# Altium schematic sheet shutdown_circuit.SchDoc
size A4
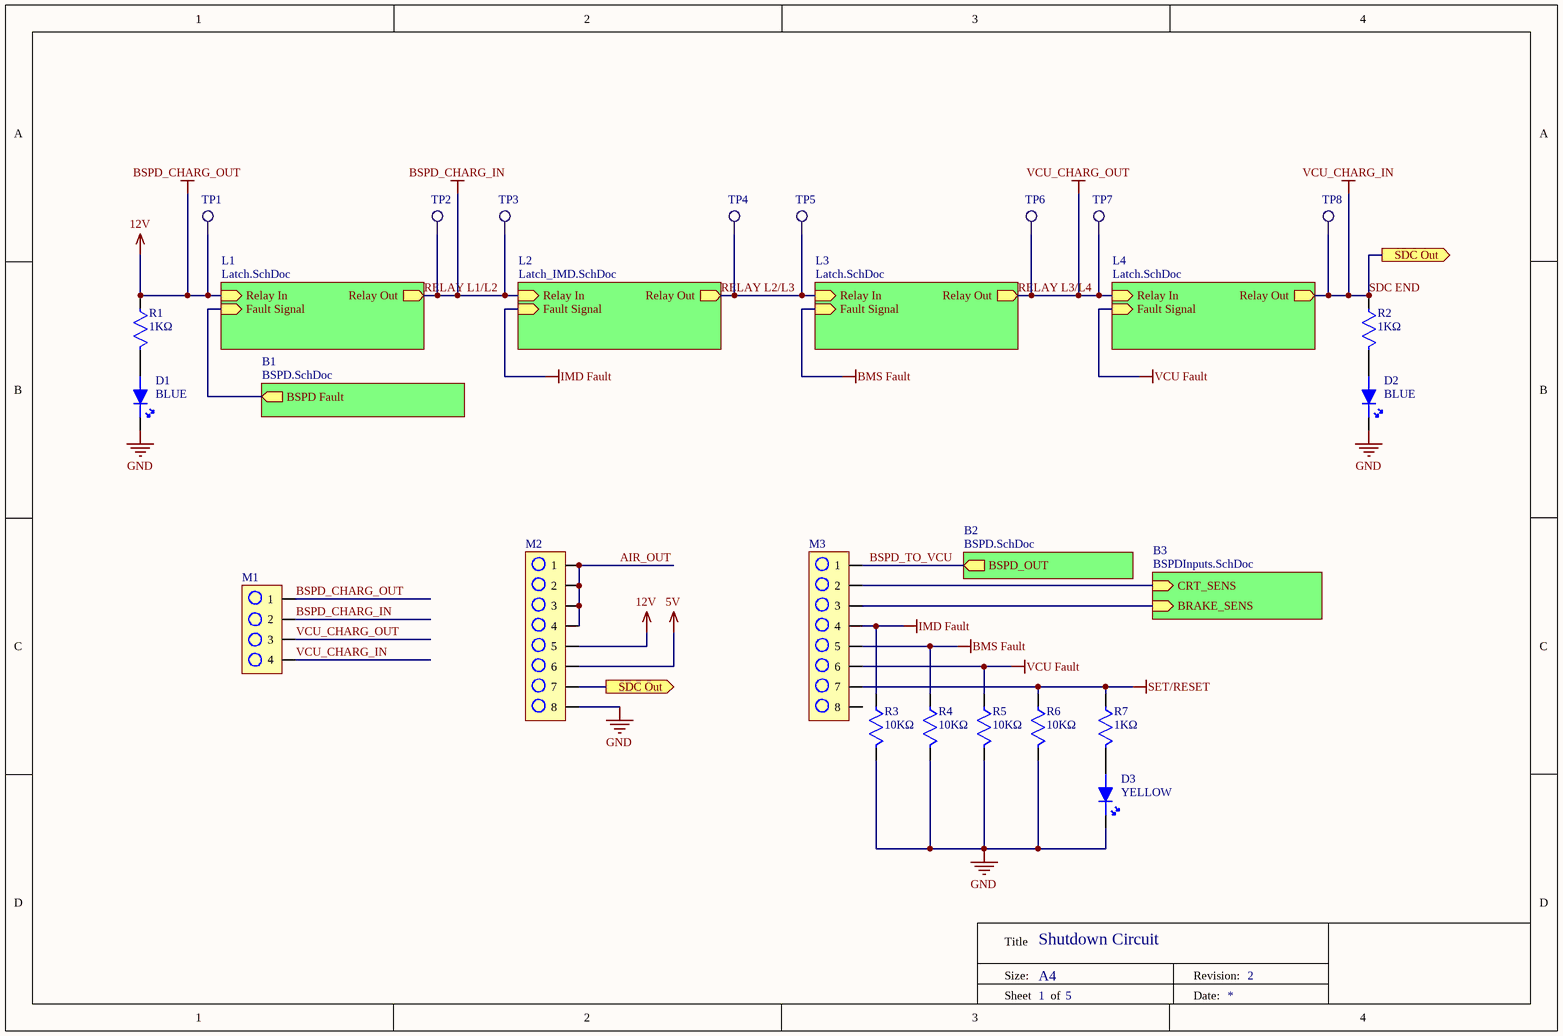
[diagram p0: shutdown_circuit.SchDoc]

## Parts
D1  BLUE  [LED 0603]
D2  BLUE  [LED 0603]
D3  YELLOW  [LED 0603]
M1  0436500428  [4-PIN MOLEX]  (value not drawn)
M2  2068320802  [4X2-PIN MOLEX]  (value not drawn)
M3  2068320802  [4X2-PIN MOLEX]  (value not drawn)
R1  1KΩ  [RESISTOR 0603]
R2  1KΩ  [RESISTOR 0603]
R3  10KΩ  [RESISTOR 0603]
R4  10KΩ  [RESISTOR 0603]
R5  10KΩ  [RESISTOR 0603]
R6  10KΩ  [RESISTOR 0603]
R7  1KΩ  [RESISTOR 0603]
TP1  Testpoint2  [TP2]  (value not drawn)
TP2  Testpoint2  [TP2]  (value not drawn)
TP3  Testpoint2  [TP2]  (value not drawn)
TP4  Testpoint2  [TP2]  (value not drawn)
TP5  Testpoint2  [TP2]  (value not drawn)
TP6  Testpoint2  [TP2]  (value not drawn)
TP7  Testpoint2  [TP2]  (value not drawn)
TP8  Testpoint2  [TP2]  (value not drawn)

## Sub-sheets
B1 = BSPD.SchDoc: BSPD Fault (out)
B2 = BSPD.SchDoc: BSPD_OUT (out)
B3 = BSPDInputs.SchDoc: CRT_SENS (in), BRAKE_SENS (in)
L1 = Latch.SchDoc: Relay In (in), Relay Out (out), Fault Signal (in)
L2 = Latch_IMD.SchDoc: Relay In (in), Relay Out (out), Fault Signal (in)
L3 = Latch.SchDoc: Relay In (in), Relay Out (out), Fault Signal (in)
L4 = Latch.SchDoc: Relay In (in), Relay Out (out), Fault Signal (in)

## Ports
SDC Out (out)

## Nets
5V: M2.6
BMS Fault: M3.5 R4.1 ; sheet L3/Fault Signal
BSPD_CHARG_IN: M1.2 TP2.1 TP3.1 ; sheet L1/Relay Out, sheet L2/Relay In  [also labelled RELAY L1/L2]
BSPD_CHARG_OUT: M1.1 M2.5 R1.1 TP1.1 ; sheet L1/Relay In  [also labelled 12V]
GND: D1.2 D2.2 D3.2 M2.8 R3.2 R4.2 R5.2 R6.2
IMD Fault: M3.4 R3.1 ; sheet L2/Fault Signal
RELAY L3/L4: M1.3 TP6.1 TP7.1 ; sheet L3/Relay Out, sheet L4/Relay In  [also labelled VCU_CHARG_OUT]
SDC END: M1.4 M2.7 R2.1 TP8.1 ; port SDC Out, sheet L4/Relay Out  [also labelled VCU_CHARG_IN]
SET/RESET: M3.7 R6.1 R7.1
VCU Fault: M3.6 R5.1 ; sheet L4/Fault Signal
AIR_OUT: M2.1 M2.2 M2.3 M2.4
BSPD_TO_VCU: M3.1 ; sheet B2/BSPD_OUT
RELAY L2/L3: TP4.1 TP5.1 ; sheet L2/Relay Out, sheet L3/Relay In
NetD1_1: D1.1 R1.2
NetD2_1: D2.1 R2.2
NetD3_1: D3.1 R7.2
NetM3_2: M3.2 ; sheet B3/CRT_SENS
NetM3_3: M3.3 ; sheet B3/BRAKE_SENS
(unnamed): sheet L1/Fault Signal, sheet B1/BSPD Fault

Not connected (* = marked no-connect by the designer): M3 8

## Notes on the sheet
- Shutdown Circuit
- 2
- 1
- 5
- Title
- Size:
- A4
- Revision:
- Sheet
- of
- Date:

## Library data of the parts
D1 D2 = LTST-C191TBKT-5A: LED BLUE CLEAR CHIP SMD; Manufacturer: Vishay Lite-On; Lens Color: Colorless; Lens Style: Diffused,Colorless,Rectangular; Viewing Angle: 130°; Forward Current: 20mA; Forward Voltage: 2.8V; Luminous Intensity: 15mcd; Test Current: 5mA; Dominant Wavelength: 473nm; Number of LEDs: 1; Voltage: 29V; Supplier 1: Digi-Key; Manufacturer Part Number: LTST-C191TBKT-5A; Stock 1: 9654; Pricing 1: 1=0.5, 10=0.359, 100=0.1596, 500=0.11172, 1000=0.09177, 2500=0.0798 (USD); Mount: Surface Mount; Case/Package: 0603; Number of Pins: 2; Color: Blue; Case Code (Metric): 1608; Case Code (Imperial): 0603; Min Operating Temperature: -20°C; Max Operating Temperature: 80°C; Packaging: Tape and Reel; Package Quantity: 5000; Illumination Color: Blue; Lens Transparency: Clear; Length: 1.6mm; Height: 0.55mm; Width: 0.8mm; Radiation Hardening: No; ComponentLink1URL: http://optoelectronics.liteon.com/upload/download/DS22-2003-020/LTST-C191TBKT-5A.pdf?src-supplier=Digi-Key; ComponentLink1Description: http://optoelectronics.liteon.com/upload/download/DS22-2003-020/LTST-C191TBKT-5A.pdf?src-supplier=Digi-Key; ComponentLink2URL: http://components.arrow.com/part/dataview/52218576S9813001N1331?src-supplier=Arrow; ComponentLink2Description: http://components.arrow.com/part/dataview/52218576S9813001N1331?src-supplier=Arrow; ComponentLink3URL: http://optoelectronics.liteon.com/zh-cn/api/DwonloadFileHandler.ashx?txtSpecNo=DS22-2003-020&txtPartNo=LTST-C191TBKT-5A&src-supplier=Avnet; ComponentLink3Description: http://optoelectronics.liteon.com/zh-cn/api/DwonloadFileHandler.ashx?txtSpecNo=DS22-2003-020&txtPartNo=LTST-C191TBKT-5A&src-supplier=Avnet; ComponentLink4URL: http://www.mouser.com/ds/2/239/LTST-C191TBKT-5A-1150649.pdf?src-supplier=Mouser; ComponentLink4Description: http://www.mouser.com/ds/2/239/LTST-C191TBKT-5A-1150649.pdf?src-supplier=Mouser; Supplier Part Number 1: 160-2212-6-ND; Category: Optoelectronics
D3 = LTST-C191KSKT: LED YELLOW CLEAR SMD; Manufacturer: Vishay Lite-On; Lens Color: Colorless; Viewing Angle: 130°; Lens Style: Diffused,Colorless,Rectangular,Clear; Luminous Intensity: 180mcd; Forward Current: 30mA; Forward Voltage: 2.4V; Power Rating: 75mW; Dominant Wavelength: 597nm; Test Current: 20mA; Number of Elements: 1; Wavelength: 588nm; Reverse Voltage: 5V; Supplier 1: Digi-Key; Manufacturer Part Number: LTST-C191KSKT; Stock 1: 464545; Pricing 1: 1=0.29, 10=0.215, 100=0.1016, 500=0.06774, 1000=0.05306, 2500=0.05194 (USD); Mount: Surface Mount; Case/Package: 0603; Number of Pins: 2; Color: Yellow; Case Code (Metric): 1608; Case Code (Imperial): 0603; Min Operating Temperature: -55°C; Max Operating Temperature: 85°C; Package Quantity: 1; Packaging: Tape and Reel; Illumination Color: Yellow; Lens Transparency: Clear; Power Dissipation: 75mW; Number of LEDs: 1; Length: 1.6mm; Height: 0.55mm; Width: 0.8mm; Depth: 0.8mm; Radiation Hardening: No; Lead Free: Lead Free; ComponentLink1URL: http://optoelectronics.liteon.com/upload/download/DS22-2000-224/LTST-C191KSKT.PDF?src-supplier=Digi-Key; ComponentLink1Description: http://optoelectronics.liteon.com/upload/download/DS22-2000-224/LTST-C191KSKT.PDF?src-supplier=Digi-Key; ComponentLink2URL: https://www.verical.com/server-webapp/html/getDatasheet?partID=141495&src-supplier=Verical; ComponentLink2Description: https://www.verical.com/server-webapp/html/getDatasheet?partID=141495&src-supplier=Verical; ComponentLink3URL: http://www.mouser.com/ds/2/239/LTST-C191KSKT-1141271.pdf?src-supplier=Mouser; ComponentLink3Description: http://www.mouser.com/ds/2/239/LTST-C191KSKT-1141271.pdf?src-supplier=Mouser; ComponentLink4URL: http://www1.futureelectronics.com/doc/LITE%20ON/LITE-ON%20LTST-C191KSKT.pdf?src-supplier=Future+Electronics; ComponentLink4Description: http://www1.futureelectronics.com/doc/LITE%20ON/LITE-ON%20LTST-C191KSKT.pdf?src-supplier=Future+Electronics; Category: Optoelectronics; Supplier Part Number 1: 160-1448-6-ND
M1 = 0436500428: Conn Power HDR 4 POS 3mm Solder ST Thru-Hole 4 Terminal 1 Port Micro-Fit 3.0™ Tray; Manufacturer: Molex; Number of Positions: 4; Connector Type: Male Pin; Number of Ports: 1; Supplier 1: Digi-Key; Manufacturer Part Number: 0436500428; Stock 1: 1193; Pricing 1: 1=1.44, 10=1.265, 100=1.0916, 500=0.89316, 1000=0.79392, 5000=0.69468, 10000=0.65995 (USD); Mount: Through Hole; Contact Plating: Gold; Color: Black; Contact Material: Brass; Housing Material: Polymer; Number of Terminals: 4; Min Operating Temperature: -40°C; Max Operating Temperature: 105°C; Packaging: Tray; Number of Rows: 1; Termination: Solder; Fastening Type: Ramp; Number of Contacts: 4; Orientation: Straight; Package Quantity: 2040; Length: 15.65mm; Pitch: 3mm; Depth: 5.57mm; ComponentLink1URL: http://www.molex.com/pdm_docs/sd/436500428_sd.pdf?src-supplier=Digi-Key; ComponentLink1Description: http://www.molex.com/pdm_docs/sd/436500428_sd.pdf?src-supplier=Digi-Key; ComponentLink2URL: http://www.molex.com/webdocs/datasheets/pdf/en-us/0436500428_PCB_HEADERS.pdf?src-supplier=Avnet; ComponentLink2Description: http://www.molex.com/webdocs/datasheets/pdf/en-us/0436500428_PCB_HEADERS.pdf?src-supplier=Avnet; Supplier Part Number 1: WM10669-ND; Category: Connectors, Interconnects
M2 M3 = 2068320802: CONN HEADER 4X2 POS, 3.00mm Pitch; Vendor: Molex Connector Corporation; Built_By: Molex_Team; SourceLibrary: Molex_2020-09-22; Manufacturer_Part_Number: 2068320802; Copyright: Copyright (C) 2018 Accelerated Designs. All rights reserved; RefDes: RefDes; Type: DEV
R1 R2 R7 = CRCW06031K00FKEA: RES SMD 1K OHM 1% 1/10W 0603; Manufacturer: Vishay Dale; Resistance: 1kR; Temperature Coefficient: 100ppm/°C; Power Rating: 100mW; Voltage Rating: 75V; Supplier 1: Digi-Key; Manufacturer Part Number: CRCW06031K00FKEA; Stock 1: 1811474; Pricing 1: 1=0.1, 10=0.034, 100=0.0139, 1000=0.00623, 2500=0.0054 (USD); Mount: Surface Mount; Case/Package: 0603; Number of Pins: 2; Weight: 7.1E-05oz; Contact Plating: Tin; Case Code (Metric): 1608; Case Code (Imperial): 0603; Min Operating Temperature: -55°C; Max Operating Temperature: 155°C; Composition: Thick Film; Tolerance: 1%; Termination: SMD/SMT; Packaging: Tape and Reel; Package Quantity: 10; Number of Terminations: 2; Military Standard: Not; Max Power Dissipation: 100mW; Voltage Rating (DC): 75V; Features: Automotive AEC-Q200; Length: 1.55mm; Height: 0.45mm; Width: 0.033inch; Depth: 0.85mm; Radiation Hardening: No; Lead Free: Lead Free; REACH SVHC: Unknown; ComponentLink1URL: http://www.vishay.com/docs/20035/dcrcwe3.pdf?src-supplier=Digi-Key; ComponentLink1Description: http://www.vishay.com/docs/20035/dcrcwe3.pdf?src-supplier=Digi-Key; ComponentLink2URL: http://uk.rs-online.com/webdocs/0d98/0900766b80d98afc.pdf?src-supplier=RSComponents; ComponentLink2Description: http://uk.rs-online.com/webdocs/0d98/0900766b80d98afc.pdf?src-supplier=RSComponents; ComponentLink3URL: http://www.vishay.com/docs/20035/dcrcwe3.pdf?src-supplier=Avnet; ComponentLink3Description: http://www.vishay.com/docs/20035/dcrcwe3.pdf?src-supplier=Avnet; ComponentLink4URL: http://www.vishay.com/docs/20035/dcrcwe3.pdf?src-supplier=Avnet+Asia; ComponentLink4Description: http://www.vishay.com/docs/20035/dcrcwe3.pdf?src-supplier=Avnet+Asia; ComponentLink5URL: http://www.farnell.com/datasheets/2310790.pdf?src-supplier=Element14; ComponentLink5Description: http://www.farnell.com/datasheets/2310790.pdf?src-supplier=Element14; ComponentLink6URL: https://www.distrelec.biz/Web/Downloads/a_/en/flD-CRCW-e3_data_en.pdf?mime=application%2Fpdf&src-supplier=Distrelec; ComponentLink6Description: https://www.distrelec.biz/Web/Downloads/a_/en/flD-CRCW-e3_data_en.pdf?mime=application%2Fpdf&src-supplier=Distrelec; ComponentLink7URL: http://www.vishay.com/docs/20035/dcrcwe3.pdf?src-supplier=Future+Electronics; ComponentLink7Description: http://www.vishay.com/docs/20035/dcrcwe3.pdf?src-supplier=Future+Electronics; ComponentLink8URL: http://www.vishay.com/docs/20035/dcrcwe3.pdf?src-supplier=Avnet+Europe; ComponentLink8Description: http://www.vishay.com/docs/20035/dcrcwe3.pdf?src-supplier=Avnet+Europe; Supplier Part Number 1: 541-1.00KHCT-ND; Category: Resistors
R3-R6 = CRCW060310K0FKEA: RES SMD 10K OHM 1% 1/10W 0603; Manufacturer: Vishay; Resistance: 10kR; Temperature Coefficient: 100ppm/°C; Power Rating: 100mW; Voltage Rating: 75V; Supplier 1: Digi-Key; Manufacturer Part Number: CRCW060310K0FKEA; Stock 1: 1434373; Pricing 1: 1=0.1, 10=0.034, 100=0.0139, 1000=0.00623, 2500=0.0054 (USD); Case/Package: 0603; Number of Pins: 2; Weight: 7.1E-05oz; Contact Plating: Tin,Lead; Case Code (Metric): 1608; Case Code (Imperial): 0603; Min Operating Temperature: -55°C; Max Operating Temperature: 155°C; Tolerance: 1%; Composition: Thick Film; Packaging: Tape and Reel; Package Quantity: 10; Number of Terminations: 2; Military Standard: Not; Termination: SMD/SMT; Max Power Dissipation: 100mW; Voltage Rating (DC): 75V; Features: Automotive AEC-Q200; Length: 1.55mm; Height: 0.45mm; Width: 0.033inch; Depth: 0.85mm; Radiation Hardening: No; Lead Free: Lead Free; REACH SVHC: Unknown; ComponentLink1URL: http://www.vishay.com/docs/20008/dcrcw.pdf?src-supplier=Avnet+Europe; ComponentLink1Description: http://www.vishay.com/docs/20008/dcrcw.pdf?src-supplier=Avnet+Europe; ComponentLink2URL: https://www.verical.com/server-webapp/html/getDatasheet?partID=86831&src-supplier=Verical; ComponentLink2Description: https://www.verical.com/server-webapp/html/getDatasheet?partID=86831&src-supplier=Verical; ComponentLink3URL: http://www.farnell.com/datasheets/2310790.pdf?src-supplier=Allied+Electronics; ComponentLink3Description: http://www.farnell.com/datasheets/2310790.pdf?src-supplier=Allied+Electronics; ComponentLink4URL: http://www.vishay.com/docs/20035/dcrcwe3.pdf?src-supplier=Digi-Key; ComponentLink4Description: http://www.vishay.com/docs/20035/dcrcwe3.pdf?src-supplier=Digi-Key; ComponentLink5URL: http://www.farnell.com/datasheets/2310790.pdf?src-supplier=Mouser; ComponentLink5Description: http://www.farnell.com/datasheets/2310790.pdf?src-supplier=Mouser; ComponentLink6URL: http://www.farnell.com/datasheets/2310790.pdf?src-supplier=Element14; ComponentLink6Description: http://www.farnell.com/datasheets/2310790.pdf?src-supplier=Element14; ComponentLink7URL: http://www.farnell.com/datasheets/2310790.pdf?src-supplier=Avnet; ComponentLink7Description: http://www.farnell.com/datasheets/2310790.pdf?src-supplier=Avnet; ComponentLink8URL: http://www.vishay.com/docs/20035/dcrcwe3.pdf?src-supplier=Future+Electronics; ComponentLink8Description: http://www.vishay.com/docs/20035/dcrcwe3.pdf?src-supplier=Future+Electronics; ComponentLink9URL: http://uk.rs-online.com/webdocs/0d98/0900766b80d98afc.pdf?src-supplier=RSComponents; ComponentLink9Description: http://uk.rs-online.com/webdocs/0d98/0900766b80d98afc.pdf?src-supplier=RSComponents; ComponentLink10URL: http://www.farnell.com/datasheets/2310790.pdf?src-supplier=Distrelec; ComponentLink10Description: http://www.farnell.com/datasheets/2310790.pdf?src-supplier=Distrelec; Supplier Part Number 1: 541-10.0KHCT-ND; Category: Resistors
TP1-TP8 = Testpoint2: Single layer pad TP